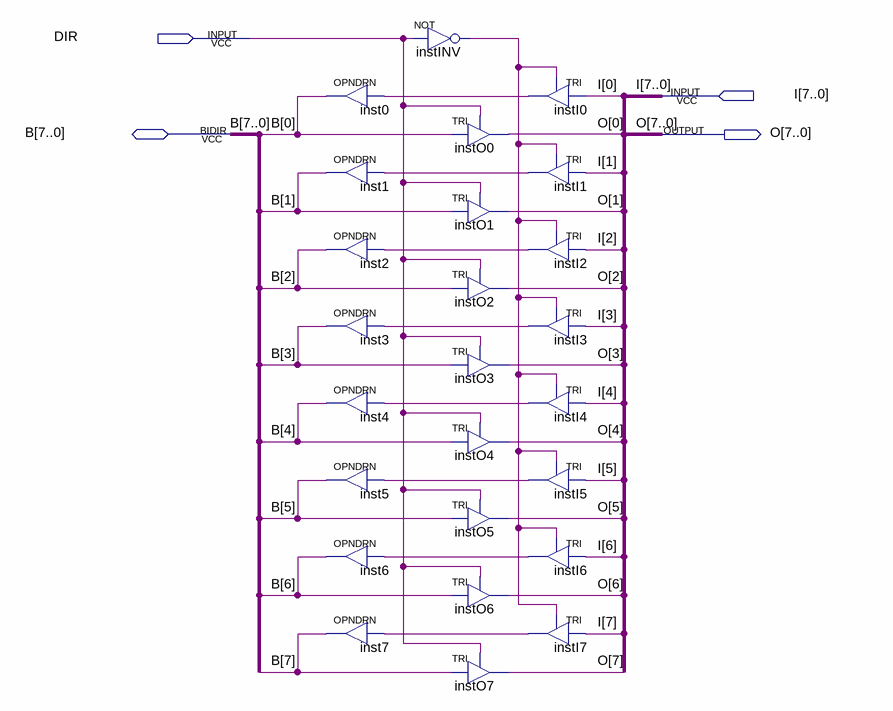
[diagram p0: schematic sheet]
// Quartus schematic 8bidir16o_B.bdf as structural Verilog: 25 symbols, 4 pins
module \8bidir16o_B  (
  input  DIR,
  input  [7:0] I,
  inout  [7:0] B,
  output [7:0] O
);

  wire instI0_out, instI1_out, instI2_out, instI3_out, instI4_out, instI5_out, instI6_out, instI7_out,
       instINV_out;

  OPNDRN inst0 (.IN(instI0_out), .OUT(B[0]));
  OPNDRN inst1 (.IN(instI1_out), .OUT(B[1]));
  OPNDRN inst2 (.IN(instI2_out), .OUT(B[2]));
  OPNDRN inst3 (.IN(instI3_out), .OUT(B[3]));
  OPNDRN inst4 (.IN(instI4_out), .OUT(B[4]));
  OPNDRN inst5 (.IN(instI5_out), .OUT(B[5]));
  OPNDRN inst6 (.IN(instI6_out), .OUT(B[6]));
  OPNDRN inst7 (.IN(instI7_out), .OUT(B[7]));
  not instINV (instINV_out, DIR);
  TRI instO0 (.IN(B[0]), .OE(DIR), .OUT(O[0]));
  TRI instO1 (.IN(B[1]), .OE(DIR), .OUT(O[1]));
  TRI instO2 (.IN(B[2]), .OE(DIR), .OUT(O[2]));
  TRI instO3 (.IN(B[3]), .OE(DIR), .OUT(O[3]));
  TRI instO4 (.IN(B[4]), .OE(DIR), .OUT(O[4]));
  TRI instO5 (.IN(B[5]), .OE(DIR), .OUT(O[5]));
  TRI instO6 (.IN(B[6]), .OE(DIR), .OUT(O[6]));
  TRI instO7 (.IN(B[7]), .OE(DIR), .OUT(O[7]));
  TRI instI0 (.IN(I[0]), .OE(instINV_out), .OUT(instI0_out));
  TRI instI1 (.IN(I[1]), .OE(instINV_out), .OUT(instI1_out));
  TRI instI2 (.IN(I[2]), .OE(instINV_out), .OUT(instI2_out));
  TRI instI3 (.IN(I[3]), .OE(instINV_out), .OUT(instI3_out));
  TRI instI4 (.IN(I[4]), .OE(instINV_out), .OUT(instI4_out));
  TRI instI5 (.IN(I[5]), .OE(instINV_out), .OUT(instI5_out));
  TRI instI6 (.IN(I[6]), .OE(instINV_out), .OUT(instI6_out));
  TRI instI7 (.IN(I[7]), .OE(instINV_out), .OUT(instI7_out));
endmodule
